# Altium schematic sheet Pixel1.0_2.SchDoc: Pixel1.0
size 409 x 282 mm; Date: 5/11/2016 6:59:09 PM; SheetNumber: 3
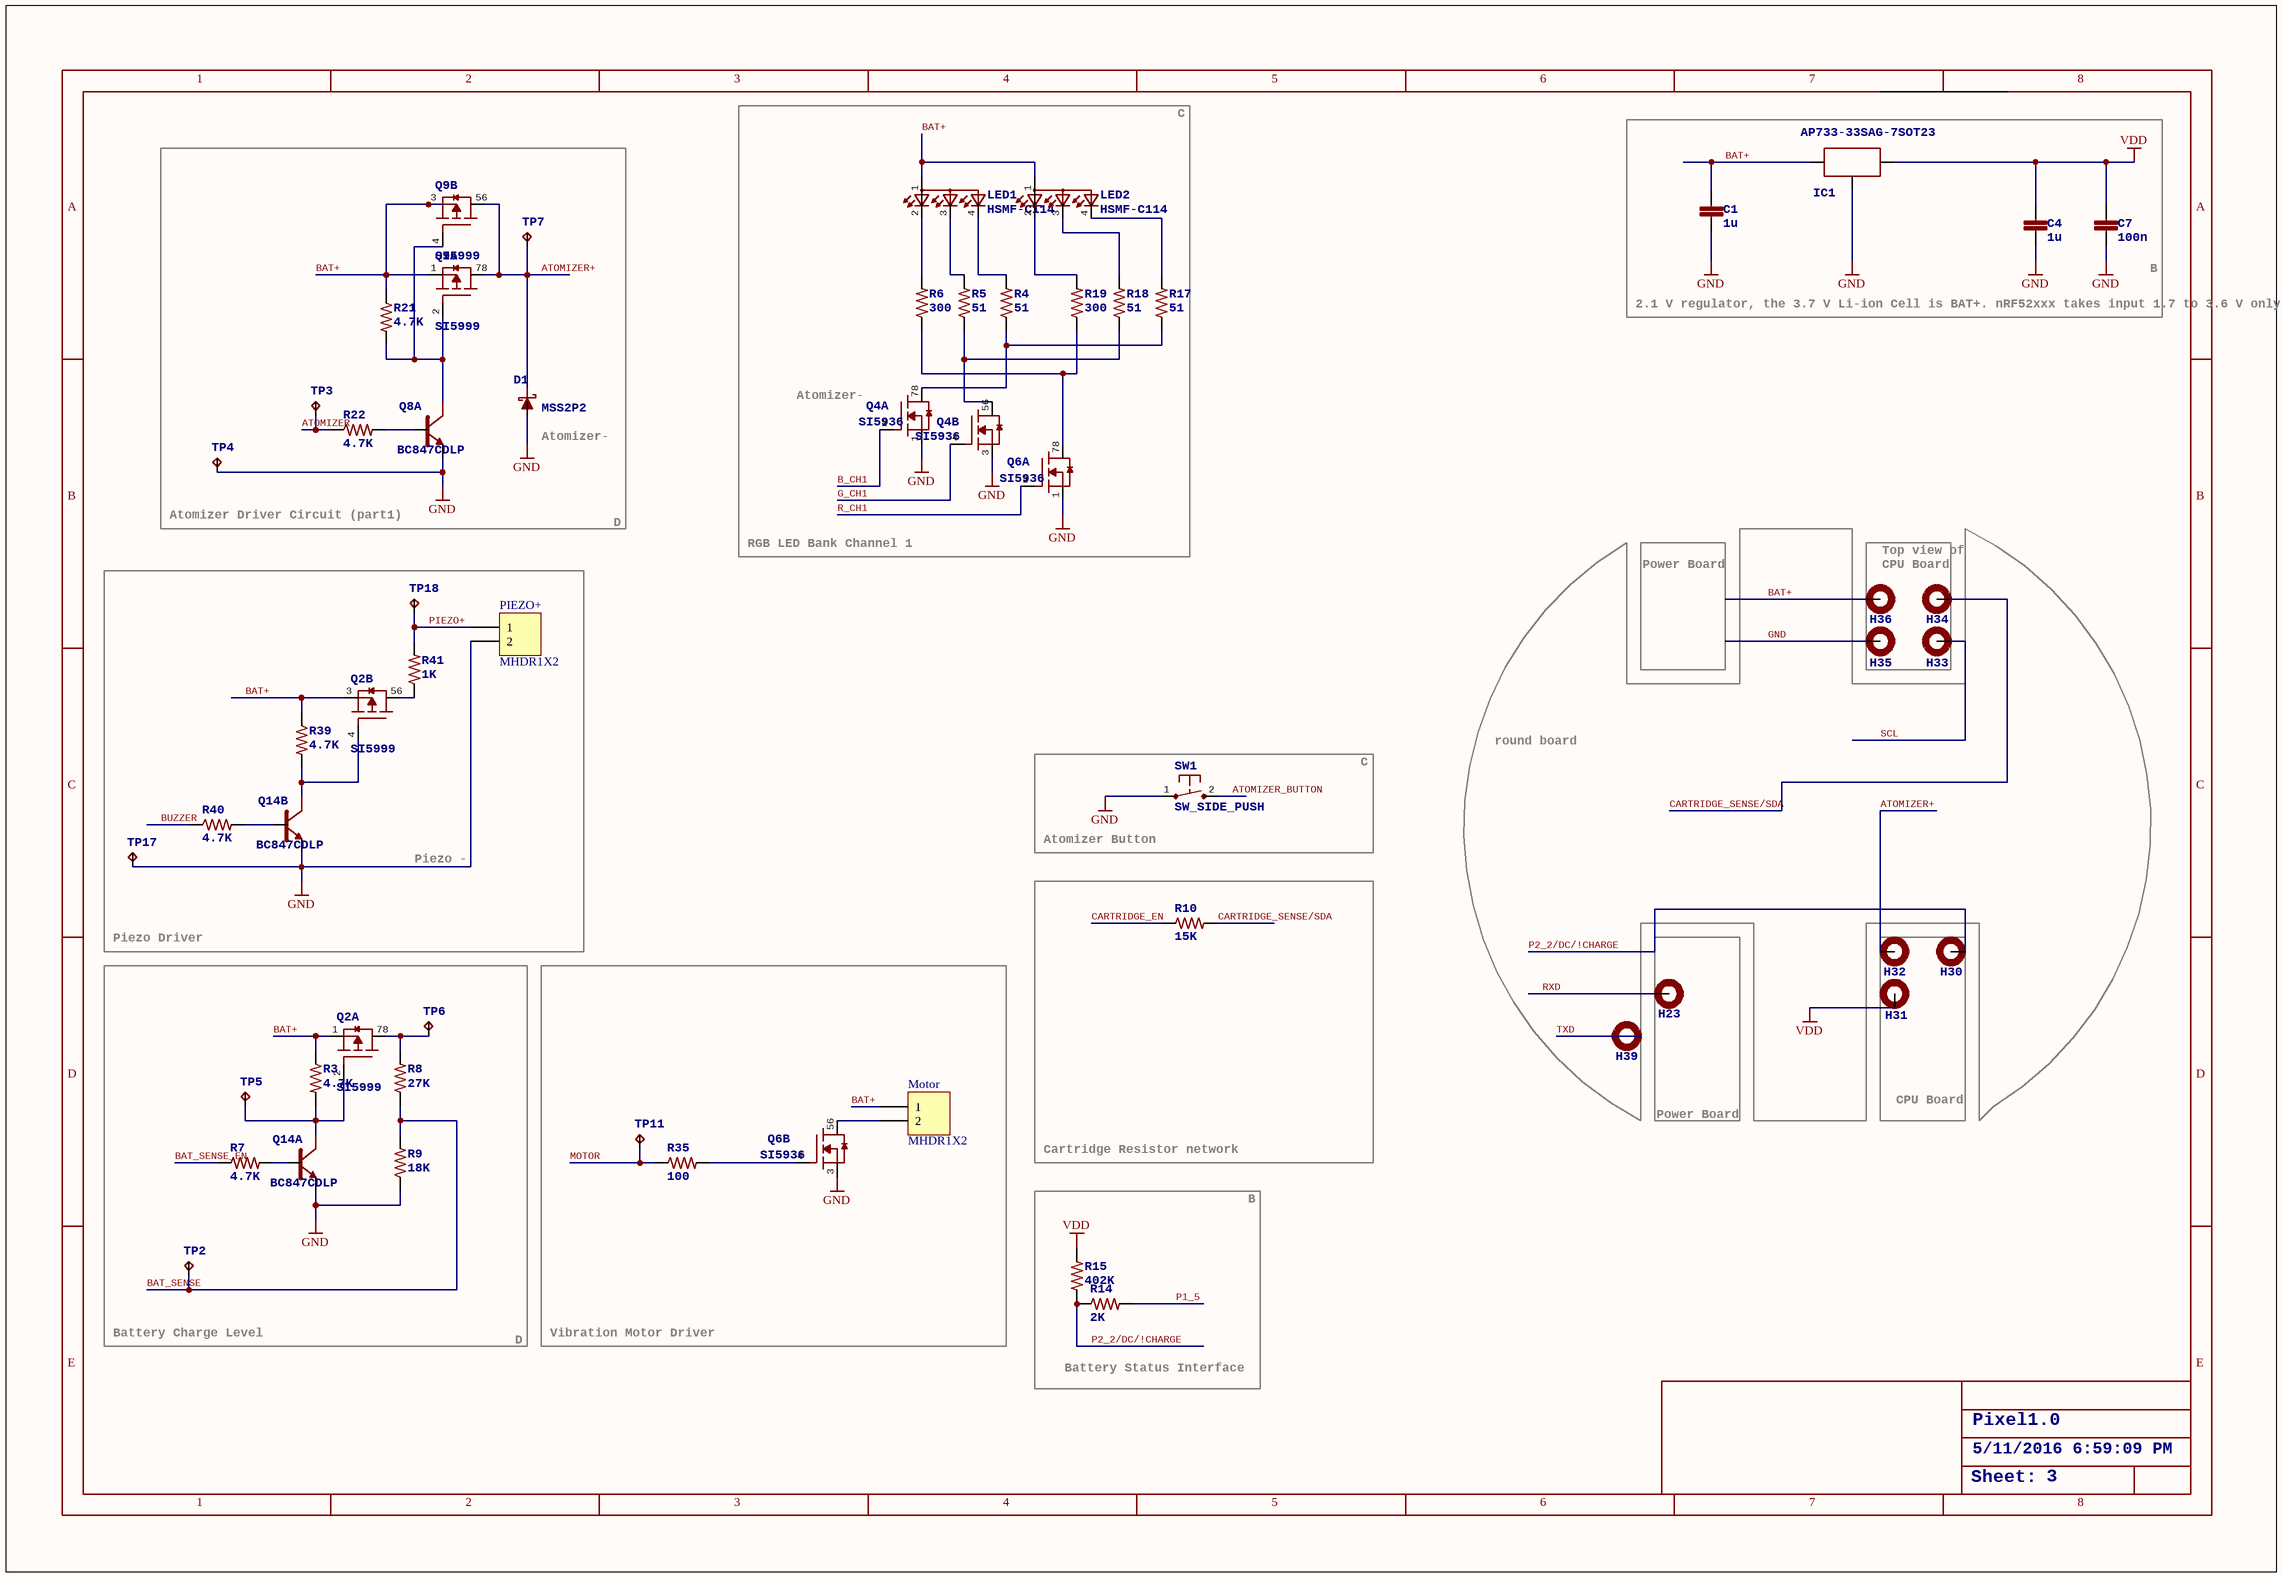
[diagram p0: Pixel1.0_2.SchDoc]

## Parts
C1  1u  [C0603]
C4  1u  [C0603]
C7  100n  [C0603]
D1  MSS2P2  [MICROSMP]
H23  MOUNT-PAD-ROUND1.5MMX1MM  [TMOUNT4]  (value not drawn)
H30  MOUNT-PAD-ROUNDTMOUNT1  [T-MOUNT1]  (value not drawn)
H31  MOUNT-PAD-ROUNDTMOUNT1  [T-MOUNT1]  (value not drawn)
H32  MOUNT-PAD-ROUNDTMOUNT1  [T-MOUNT1]  (value not drawn)
H33  MOUNT-PAD-ROUNDTMOUNT1  [T-MOUNT1]  (value not drawn)
H34  MOUNT-PAD-ROUNDTMOUNT1  [T-MOUNT1]  (value not drawn)
H35  MOUNT-PAD-ROUNDTMOUNT1  [T-MOUNT1]  (value not drawn)
H36  MOUNT-PAD-ROUNDTMOUNT1  [T-MOUNT1]  (value not drawn)
H39  MOUNT-PAD-ROUND1.5MMX1MM  [TMOUNT4]  (value not drawn)
IC1  AP733-33SAG-7SOT23  [SOT23]
LED1  HSMF-C114  [HSMFC114]
LED2  HSMF-C114  [HSMFC114]
Motor  MHDR1X2  [MHDR1X2]
PIEZO+  MHDR1X2  [MHDR1X2]
Q2  SI5999  [1206-8CHIP-FET]  (parts A,B of 2)
Q4  SI5936  [1206-8CHIP-FET]  (parts A,B of 2)
Q6  SI5936  [1206-8CHIP-FET]  (parts A,B of 2)
Q8  BC847CDLP  [X2-DFN1310-6]  (part A of 2)
Q9  SI5999  [1206-8CHIP-FET]  (parts A,B of 2)
Q14  BC847CDLP  [X2-DFN1310-6]  (parts A,B of 2)
R3  4.7K  [R0201]
R4  51  [R0201]
R5  51  [R0201]
R6  300  [R0201]
R7  4.7K  [R0201]
R8  27K  [R0201]
R9  18K  [R0201]
R10  15K  [R0201]
R14  2K  [R0201]
R15  402K  [R0201]
R17  51  [R0201]
R18  51  [R0201]
R19  300  [R0201]
R21  4.7K  [R0201]
R22  4.7K  [R0201]
R35  100  [R0201]
R39  4.7K  [R0201]
R40  4.7K  [R0201]
R41  1K  [R0201]
SW1  SW_SIDE_PUSH  [SW1]
TP2  TPTP06R  [TP06R]  (value not drawn)
TP3  TPTP06R  [TP06R]  (value not drawn)
TP4  TPTP06R  [TP06R]  (value not drawn)
TP5  TPTP06R  [TP06R]  (value not drawn)
TP6  TPTP06R  [TP06R]  (value not drawn)
TP7  TPTP06R  [TP06R]  (value not drawn)
TP11  TPTP06R  [TP06R]  (value not drawn)
TP17  TPTP06R  [TP06R]  (value not drawn)
TP18  TPTP06R  [TP06R]  (value not drawn)

## Blocks framed on the sheet
B: C1 C4 C7 IC1
Cartridge Resistor network: R10
Vibration Motor Driver: Motor Q6 R35 TP11
Power Board: H23
CPU Board: H30-H32

## Nets
GND: C1.1 C4.1 C7.1 D1.A H35.1(MOUNT) IC1.3(GND) PIEZO+.2 Q4.1(S1) Q4.3(S2) Q6.1(S1) Q6.3(S2) Q8.E1(E) Q14.E1(E) Q14.E2(E) R9.1 SW1.1(P) TP4.TP TP17.TP
VDD: C4.2 C7.2 H31.1(MOUNT) IC1.2(OUT) R15.1
ATOMIZER: R22.1 TP3.TP
ATOMIZER+: D1.K H32.1(MOUNT) Q9.56(D2) Q9.78(D1) TP7.TP
ATOMIZER_BUTTON: SW1.2(S)
B_CH1: Q4.2(G1)
BAT+: C1.2 H36.1(MOUNT) IC1.1(IN) LED1.1(A) LED2.1(A) Motor.1 Q2.1(S1) Q2.3(S2) Q9.1(S1) Q9.3(S2) R3.1 R21.1 R39.1
BAT_SENSE: R8.1 R9.2 TP2.TP
BAT_SENSE_EN: R7.1
BUZZER: R40.1
CARTRIDGE_EN: R10.1
CARTRIDGE_SENSE/SDA: H34.1(MOUNT) R10.2
G_CH1: Q4.4(G2)
MOTOR: R35.1 TP11.TP
P1_5: R14.2
P2_2/DC/!CHARGE: H30.1(MOUNT) R14.1 R15.2
PIEZO+: PIEZO+.1 R41.2 TP18.TP
R_CH1: Q6.2(G1)
RXD: H23.1(MOUNT)
SCL: H33.1(MOUNT)
TXD: H39.1(MOUNT)
NetLED1_2: LED1.2(RED) R6.2
NetLED1_3: LED1.3(GREEN) R5.2
NetLED1_4: LED1.4(BLUE) R4.2
NetLED2_2: LED2.2(RED) R19.2
NetLED2_3: LED2.3(GREEN) R18.2
NetLED2_4: LED2.4(BLUE) R17.2
NetMotor_2: Motor.2 Q6.56(D2)
NetQ2_2: Q2.2(G1) Q14.C1(C) R3.2 TP5.TP
NetQ2_4: Q2.4(G2) Q14.C2(C) R39.2
NetQ2_56: Q2.56(D2) R41.1
NetQ2_78: Q2.78(D1) R8.2 TP6.TP
NetQ4_56: Q4.56(D2) R5.1 R18.1
NetQ4_78: Q4.78(D1) R4.1 R17.1
NetQ6_4: Q6.4(G2) R35.2
NetQ6_78: Q6.78(D1) R6.1 R19.1
NetQ8_B1: Q8.B1(B) R22.2
NetQ8_C1: Q8.C1(C) Q9.2(G1) Q9.4(G2) R21.2
NetQ14_B1: Q14.B1(B) R7.2
NetQ14_B2: Q14.B2(B) R40.2

## Notes on the sheet
- C
- 2.1 V regulator, the 3.7 V Li-ion Cell is BAT+. nRF52xxx takes input 1.7 to 3.6 V only.
- (near Q4) Atomizer-
- (near D1) Atomizer-
- Atomizer Driver Circuit (part1)
- D
- RGB LED Bank Channel 1
- Power Board
- Top view of
- CPU Board
- round board
- Piezo -
- (near SW1) Atomizer Button
- Piezo Driver
- B
- Battery Charge Level
- Battery Status Interface
- Pixel1.0
- 5/11/2016 6:59:09 PM
- Sheet:
- 3
- 1
- 2
- 4
- 5
- 6
- 7
- 8
- A
- E

## Library data of the parts
C1 C4 C7 = C-EUC0603: CAPACITOR, European symbol
H23 H39 = MOUNT-PAD-ROUND1.5MMX1MM: MOUNTING PAD, round
H30-H36 = MOUNT-PAD-ROUNDTMOUNT1: MOUNTING PAD, round
LED1 LED2 = HSMF-C114: Chip LED RGB   Source: http://document.sharpsma.com/files/GM1WA55311A_SS.pdf
Motor PIEZO+ = MHDR1X2: Header, 2-Pin; LatestRevisionDate: 17-Jul-2002; LatestRevisionNote: Re-released for DXP Platform.; Publisher: Altium Limited
Q2 Q9 = SI5999: Dual N-Channel 30-V (D-S) MOSFET   Source: http://www.vishay.com/docs/71053/71053.pdf
Q8 Q14 = BC847CDLP: http://www.diodes.com/datasheets/ds30817.pdf
R3-R10 R14 R15 R17-R19 R21 R22 R35 R39-R41 = R-US_R0201: RESISTOR, American symbol
TP2-TP7 TP11 TP17 TP18 = TPTP06R: Test pad